# EAGLE schematic ArduSatPayloadProcessorModule (EAGLE 6.3), part 2 of 2
## Sheet 19 of 19
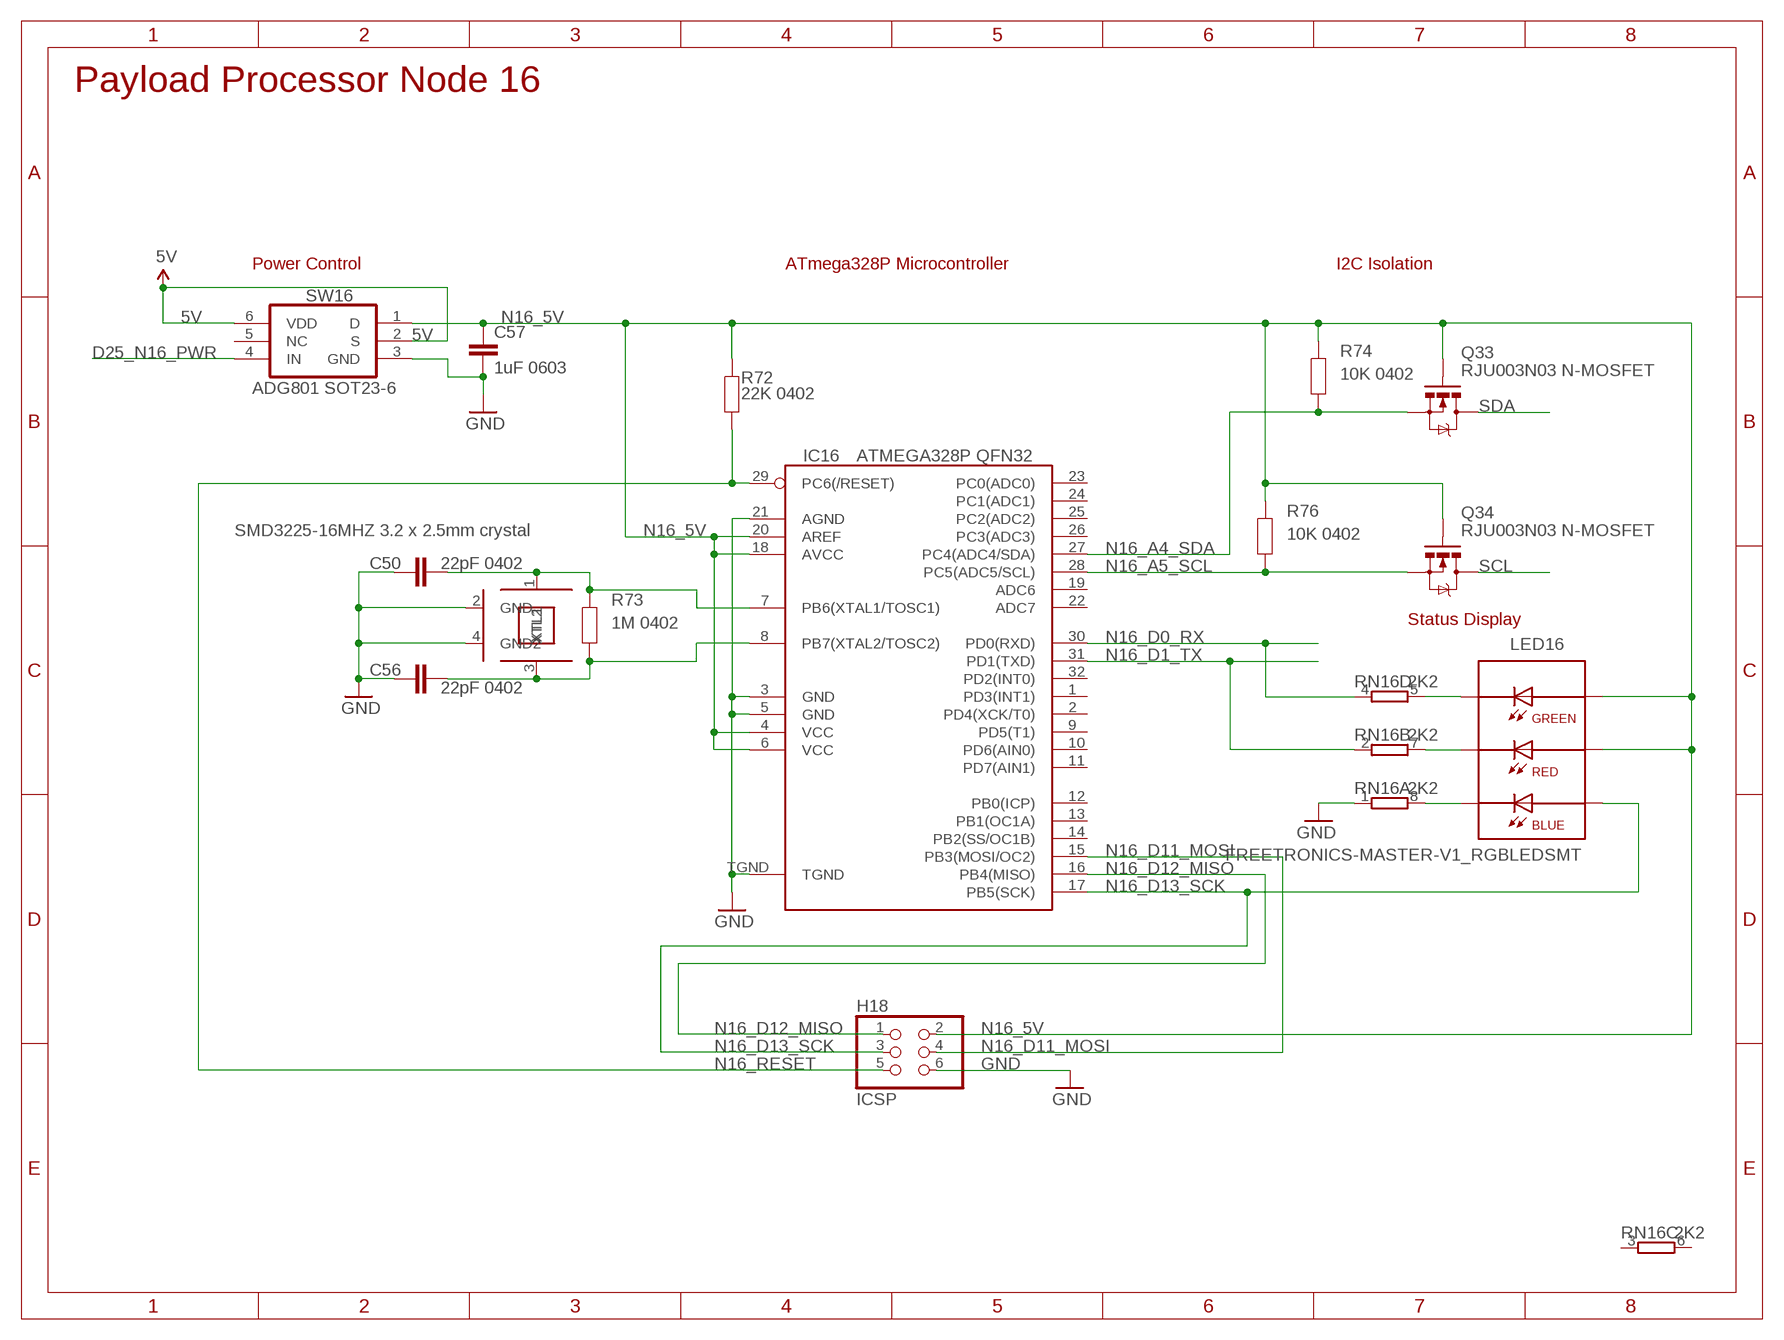
[diagram p18: schematic, sheet 19]

### Parts
C50  22pF 0402  C-EU0402C  [0402C]
C56  22pF 0402  C-EU0402C  [0402C]
C57  1uF 0603  C-EUC0603  [C0603]
H18  ICSP  ICSP2X3-2MM  [M2X3-2MM]
IC16  ATMEGA328P QFN32  AVR-MEGA8-MI  [MLF32]
LED16  FREETRONICS-MASTER-V1_RGBLEDSMT  [FREETRONICS-MASTER-V1_19-337]
Q33  RJU003N03 N-MOSFET  MOSFET-NSOT-323  [SOT32-3]
Q34  RJU003N03 N-MOSFET  MOSFET-NSOT-323  [SOT32-3]
R72  22K 0402  RESISTOR0402  [0402]
R73  1M 0402  RESISTOR0402  [0402]
R74  10K 0402  RESISTOR0402  [0402]
R76  10K 0402  RESISTOR0402  [0402]
RN16  2K2  4R-NCAY16  [CAY16]
SW16  ADG801 SOT23-6  ADG801SOT23-6  [SOT23-6]
XTL16  SMD3225-16MHZ 3.2 x 2.5mm crystal  CRYSTAL-GND3X2  [CRYSTAL-SMD-3X2]

### Nets
5V: SW16.2(S) SW16.6(VDD) ; also sheet 1,2,3,4,5,6,7,8,9,10,11,12,13,14,15,16,17,18
D25_N16_PWR: SW16.4(IN) ; also sheet 2
GND: C50.1 C56.1 C57.2 H18.6 IC16.3(GND) IC16.5(GND) IC16.21(AGND) IC16.TGND RN16.1 SW16.3(GND) XTL16.2(GND) XTL16.4(GND2) ; also sheet 1,2,3,4,5,6,7,8,9,10,11,12,13,14,15,16,17,18
N16_5V: C57.1 H18.2 IC16.4(VCC) IC16.6(VCC) IC16.18(AVCC) IC16.20(AREF) LED16.5(A-R) LED16.6(A-G) Q33.1(G) Q34.1(G) R72.2 R74.2 R76.2 SW16.1(D)
N16_A4_SDA: IC16.27(PC4(ADC4/SDA)) Q33.2(S) R74.1
N16_A5_SCL: IC16.28(PC5(ADC5/SCL)) Q34.2(S) R76.1
N16_D0_RX: IC16.30(PD0(RXD)) RN16.4 ; also sheet 2
N16_D1_TX: IC16.31(PD1(TXD)) RN16.2 ; also sheet 2
N16_D11_MOSI: H18.4 IC16.15(PB3(MOSI/OC2))
N16_D12_MISO: H18.1 IC16.16(PB4(MISO))
N16_D13_SCK: H18.3 IC16.17(PB5(SCK)) LED16.4(A-B)
N16_RESET: H18.5 IC16.29(PC6(/RESET)) R72.1 ; also sheet 3
N$9410: C56.2 IC16.8(PB7(XTAL2/TOSC2)) R73.1 XTL16.3(XTL2)
N$9411: C50.2 IC16.7(PB6(XTAL1/TOSC1)) R73.2 XTL16.1(XTL1)
N$9412: LED16.2(C-R) RN16.7
N$9413: LED16.1(C-B) RN16.8
N$9414: LED16.3(C-G) RN16.5
SCL: Q34.3(D) ; also sheet 1,2,3,4,5,6,7,8,9,10,11,12,13,14,15,16,17,18
SDA: Q33.3(D) ; also sheet 1,2,3,4,5,6,7,8,9,10,11,12,13,14,15,16,17,18
Unconnected: IC16.1(PD3(INT1)) IC16.2(PD4(XCK/T0)) IC16.9(PD5(T1)) IC16.10(PD6(AIN0)) IC16.11(PD7(AIN1)) IC16.12(PB0(ICP)) IC16.13(PB1(OC1A)) IC16.14(PB2(SS/OC1B)) IC16.19(ADC6) IC16.22(ADC7) IC16.23(PC0(ADC0)) IC16.24(PC1(ADC1)) IC16.25(PC2(ADC2)) IC16.26(PC3(ADC3)) IC16.32(PD2(INT0)) RN16.3 RN16.6 SW16.5(NC)

### Notes on the sheet
- Payload Processor Node 16
- Power Control | ATmega328P Microcontroller | I2C Isolation
- SMD3225-16MHZ 3.2 x 2.5mm crystal
- Status Display

## Library data of the parts
C1-C58 C61 C62 = freetronics-jon:C-EU: CAPACITOR, European symbol
C59 C60 = freetronics-jon:CAP_POL: Capacitor Polarized These are standard SMD and PTH capacitors. Normally 10uF, 47uF, and 100uF in electrolytic and tantalum varieties. Always verify the external diameter of the through hole cap, it varies with capacity, voltage, and manufacturer. The EIA devices should be standard.
FID1-FID8 = freetronics:FIDUCIAL: Fiducial Alignment Points Various fiducial points for machine vision alignment.
H1 H2 = freetronics-jon:CUBESATBUS
H3-H19 = freetronics-jon:ICSP
IC1-IC16 = freetronics-jon:AVR-MEGA8: MICROCONTROLLER 8 Kbytes FLASH 1 kbytes SRAM 512 bytes EEPROM USART 6-channel 10 bit ADC 2-channel 8 bit ADC
IC17 = freetronics-jon:TXB0104
IC18 IC19 = freetronics-jon:TMP102
IC20 = freetronics-jon:ATMEGA2561*: MICROCONTROLLER 256 Kbytes FLASH 4 Kbytes EEPROM 8 Kbytes SRAM 54 General Purpose I/O pins 6-channels 16-bit PWM 2 x Serial USARTs 8-channels 10-bit A/D
IC21 IC22 = freetronics-jon:MAX4372
IC23 IC24 = freetronics-jon:MUX-74HC4067-QFN
IC25 = freetronics-jon:TCA9555
JP1 = freetronics-master-v1:M06: Header 6 Standard 6-pin 0.1" header. Use with straight break away headers (SKU : PRT-00116), right angle break away headers (PRT-00553), swiss pins (PRT-00743), machine pins (PRT-00117), and female headers (PRT-00115). Molex polarized connector foot print use with SKU : PRT-08094 with associated crimp pins and housings. NOTES ON THE VARIANTS LOCK and LOCK_LONGPADS... This footprint was designed to help hold the alignment of a through-hole component (i.e. 6-pin header) while soldering it into place. You may notice that each hole has been shifted either up or down by 0.005 of an inch from it's more standard position (which is a perfectly straight line). This slight alteration caused the pins (the squares in the middle) to touch the edges of the holes. Because they are alternating, it causes a "brace" to hold the component in place. 0.005 has proven to be the perfect amount of "off-center" position when using our standard breakaway headers. Although looks a little odd when you look at the bare footprint, once you have a header in there, the alteration is very hard to notice. Also, if you push a header all the way into place, it is covered up entirely on the bottom side. This idea of altering the position of holes to aid alignment will be further integrated into the Sparkfun Library for other footprints. It can help hold any component with 3 or more connection pins.
LED1-LED16 = freetronics-master-v1:FREETRONICS-MASTER-V1_RGBLED
LED17 LED18 = freetronics-jon:LED: LEDs Standard schematic elements and footprints for 5mm, 3mm, 1206, and 0603 sized LEDs. 5mm - Spark Fun Electronics SKU : COM-00529 (and others)
MNT1-MNT4 = freetronics-jon:HOLE
P1 = freetronics-master-v1.1:USD-SOCKET: microSD Socket Push-push type uSD socket. Schematic element and footprint production proven. Spark Fun Electronics SKU : PRT-00127. tDoc lines correctly indicate media card edge positions when inserting (unlocked, locked, depressed).
Q1-Q46 = freetronics-jon:MOSFET-N: Basic N-Channel MOSFET
R1-R58 R60-R74 R76-R90 = freetronics-jon:RESISTOR: Resistor Basic schematic elements and footprints for 0603, 1206, and PTH 1/10th watt (small) resistors.
R59 R75 = freetronics-original:RESISTOR: Resistor Basic schematic elements and footprints for 0603, 1206, and PTH 1/10th watt (small) resistors.
RN1-RN16 = resistor-dil:4R-N: Array Chip Resistor Source: RS Component / Phycomp; OC_FARNELL: unknown; OC_NEWARK: unknown
RN17 RN18 = freetronics-master-v1:4R-N: Array Chip Resistor Source: RS Component / Phycomp
SJ1-SJ4 = freetronics-master-v1.1:SJ: SMD solder JUMPER
SJ5 SJ6 = freetronics-jon:SJ: SMD solder JUMPER
SJ7-SJ9 = freetronics-jon:SJC
SW1-SW16 SW18 = freetronics-jon:ADG801
SW17 = freetronics-master-v1:TAC_SWITCH_2PIN: Momentary Tactile Switch - 2 pin
X1 = con-molex:53?-06: CONNECTOR wire to board 1.25 mm (.049 inch) pitch header; OC_FARNELL: 1125368; OC_NEWARK: unknown
X2 = con-molex:53?-08: CONNECTOR wire to board 1.25 mm (.049 inch) pitch header; OC_FARNELL: 1125371; OC_NEWARK: unknown
X3 = con-molex:53?-07: CONNECTOR wire to board 1.25 mm (.049 inch) pitch header; OC_FARNELL: 9786368; OC_NEWARK: unknown
X4 = con-molex:53?-04: CONNECTOR wire to board 1.25 mm (.049 inch) pitch header; OC_FARNELL: 1125367; OC_NEWARK: unknown
XTL1-XTL17 = freetronics-jon:CRYSTAL-GND